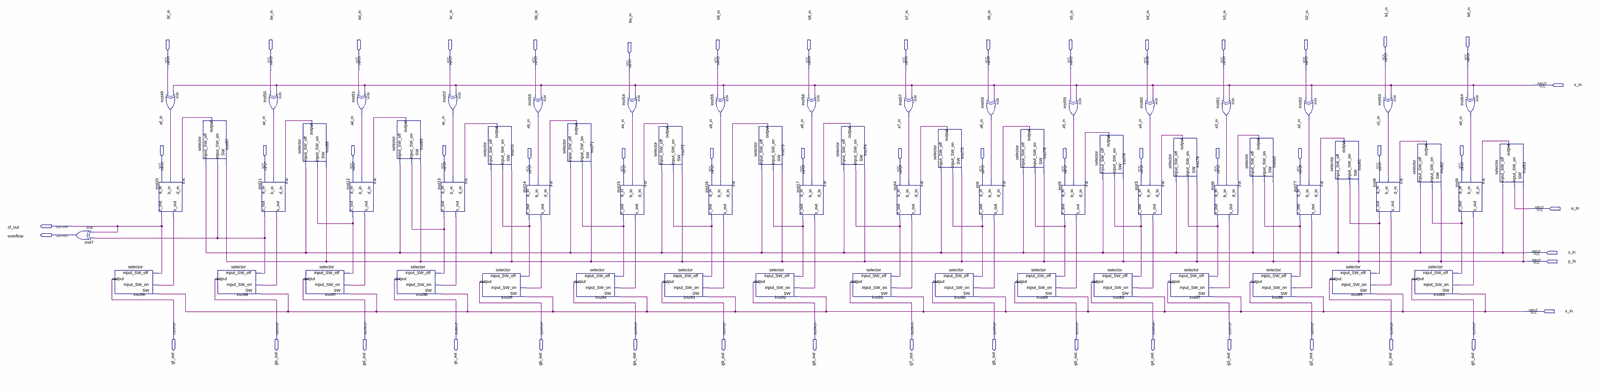
[diagram p0: schematic sheet, whole]
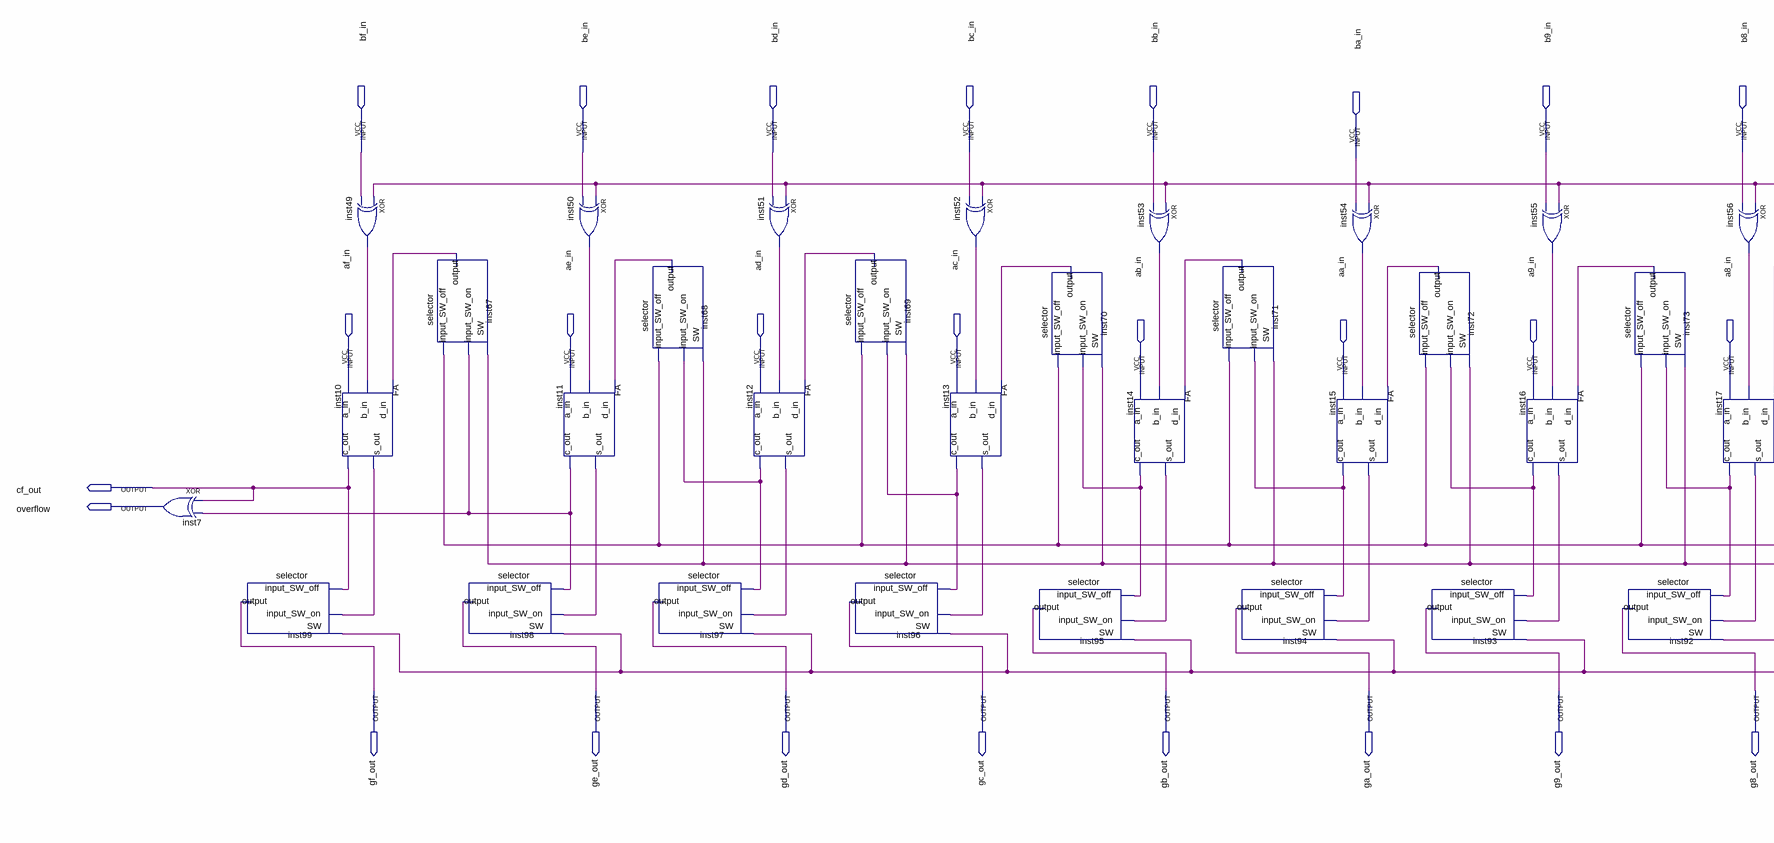
[diagram p1: schematic sheet, left part]
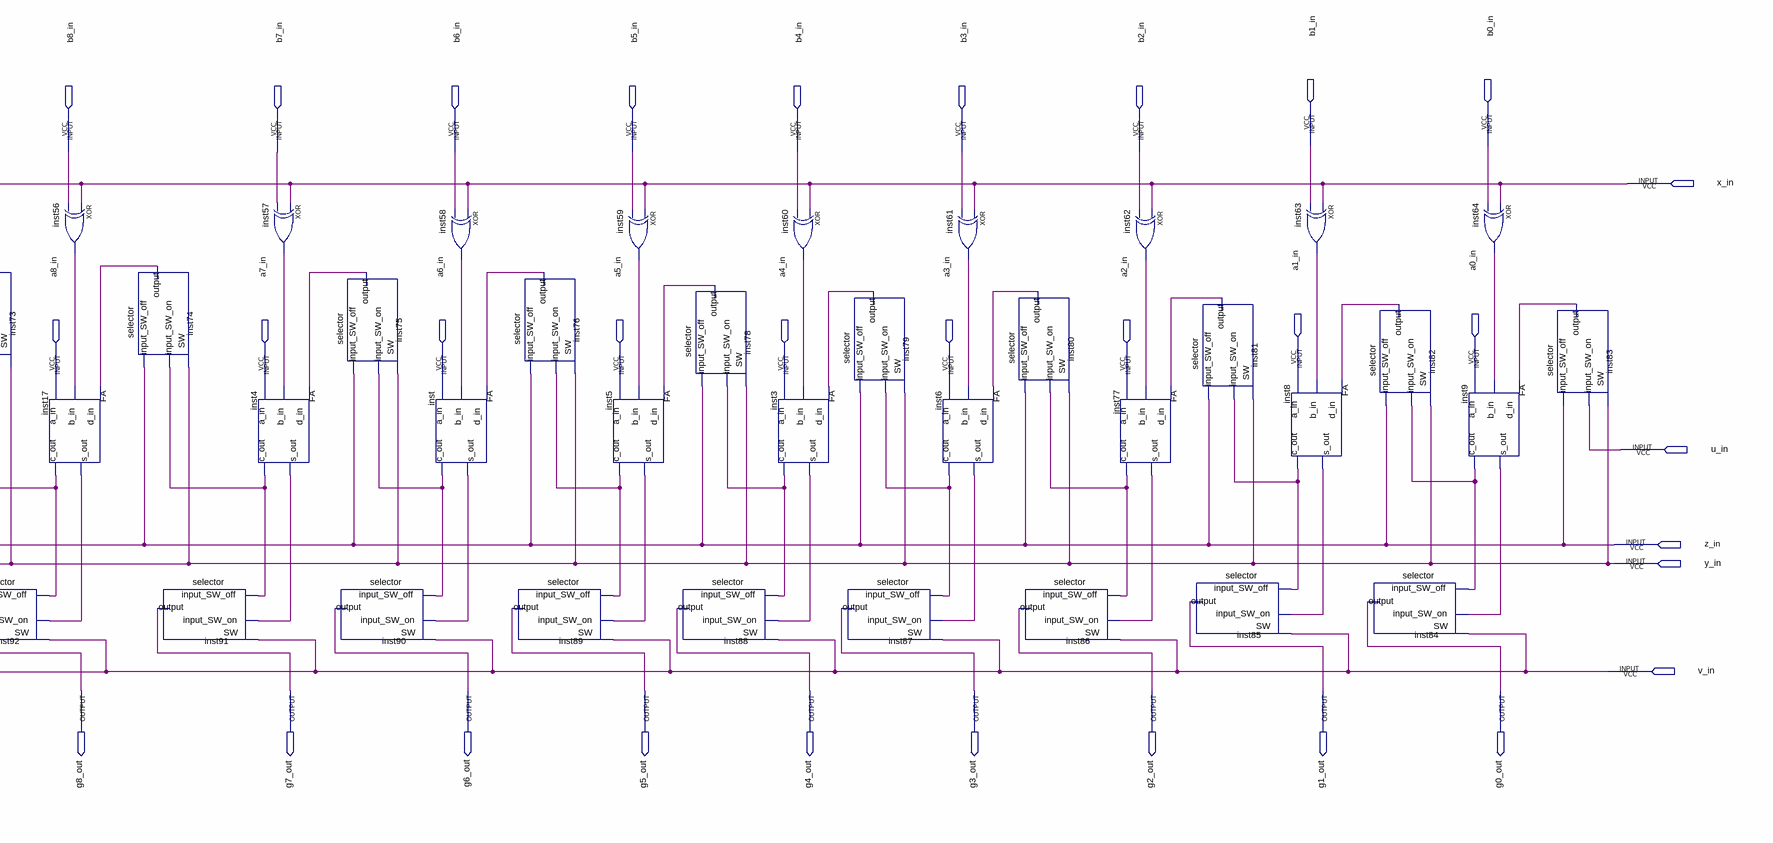
[diagram p2: schematic sheet, right part]
// Quartus schematic ALU.bdf as structural Verilog: 65 symbols, 55 pins
module ALU (
  input  b1_in,
  input  b0_in,
  input  bf_in,
  input  be_in,
  input  bd_in,
  input  bc_in,
  input  bb_in,
  input  b9_in,
  input  b8_in,
  input  b7_in,
  input  b6_in,
  input  b5_in,
  input  b4_in,
  input  b3_in,
  input  b2_in,
  input  ba_in,
  input  x_in,
  input  af_in,
  input  ae_in,
  input  ad_in,
  input  ac_in,
  input  a1_in,
  input  a0_in,
  input  ab_in,
  input  aa_in,
  input  a9_in,
  input  a8_in,
  input  a7_in,
  input  a6_in,
  input  a5_in,
  input  a4_in,
  input  a3_in,
  input  a2_in,
  input  u_in,
  input  z_in,
  input  y_in,
  input  v_in,
  output cf_out,
  output overflow,
  output gf_out,
  output ge_out,
  output gd_out,
  output gc_out,
  output gb_out,
  output ga_out,
  output g9_out,
  output g8_out,
  output g7_out,
  output g6_out,
  output g5_out,
  output g4_out,
  output g3_out,
  output g2_out,
  output g1_out,
  output g0_out
);

  wire inst3_c_out, inst3_s_out, inst4_c_out, inst4_s_out, inst5_c_out, inst5_s_out, inst6_c_out,
       inst6_s_out, inst8_c_out, inst8_s_out, inst9_c_out, inst9_s_out, inst10_s_out, inst11_c_out,
       inst11_s_out, inst12_c_out, inst12_s_out, inst13_c_out, inst13_s_out, inst14_c_out, inst14_s_out,
       inst15_c_out, inst15_s_out, inst16_c_out, inst16_s_out, inst17_c_out, inst17_s_out, inst49_out,
       inst50_out, inst51_out, inst52_out, inst53_out, inst54_out, inst55_out, inst56_out, inst57_out,
       inst58_out, inst59_out, inst60_out, inst61_out, inst62_out, inst63_out, inst64_out, inst67_output,
       inst68_output, inst69_output, inst70_output, inst71_output, inst72_output, inst73_output,
       inst74_output, inst75_output, inst76_output, inst77_c_out, inst77_s_out, inst78_output, inst79_output,
       inst80_output, inst81_output, inst82_output, inst83_output, inst_c_out, inst_s_out;

  xor inst7 (overflow, cf_out, inst11_c_out);
  selector inst99 (.input_SW_off(cf_out), .input_SW_on(inst10_s_out), .SW(v_in), .\output (gf_out));
  xor inst49 (inst49_out, x_in, bf_in);
  FA inst10 (.b_in(inst49_out), .a_in(af_in), .d_in(inst67_output), .c_out(cf_out), .s_out(inst10_s_out));
  selector inst67 (.input_SW_off(z_in), .input_SW_on(inst11_c_out), .SW(y_in), .\output (inst67_output));
  selector inst98 (.input_SW_off(inst11_c_out), .input_SW_on(inst11_s_out), .SW(v_in), .\output (ge_out));
  FA inst11 (.b_in(inst50_out), .a_in(ae_in), .d_in(inst68_output), .c_out(inst11_c_out), .s_out(inst11_s_out));
  xor inst50 (inst50_out, x_in, be_in);
  selector inst68 (.input_SW_off(z_in), .input_SW_on(inst12_c_out), .SW(y_in), .\output (inst68_output));
  selector inst97 (.input_SW_off(inst12_c_out), .input_SW_on(inst12_s_out), .SW(v_in), .\output (gd_out));
  xor inst51 (inst51_out, x_in, bd_in);
  FA inst12 (.b_in(inst51_out), .a_in(ad_in), .d_in(inst69_output), .c_out(inst12_c_out), .s_out(inst12_s_out));
  selector inst69 (.input_SW_off(z_in), .input_SW_on(inst13_c_out), .SW(y_in), .\output (inst69_output));
  selector inst96 (.input_SW_off(inst13_c_out), .input_SW_on(inst13_s_out), .SW(v_in), .\output (gc_out));
  xor inst52 (inst52_out, x_in, bc_in);
  FA inst13 (.b_in(inst52_out), .a_in(ac_in), .d_in(inst70_output), .c_out(inst13_c_out), .s_out(inst13_s_out));
  selector inst70 (.input_SW_off(z_in), .input_SW_on(inst14_c_out), .SW(y_in), .\output (inst70_output));
  selector inst95 (.input_SW_off(inst14_c_out), .input_SW_on(inst14_s_out), .SW(v_in), .\output (gb_out));
  xor inst53 (inst53_out, x_in, bb_in);
  FA inst14 (.b_in(inst53_out), .a_in(ab_in), .d_in(inst71_output), .c_out(inst14_c_out), .s_out(inst14_s_out));
  selector inst71 (.input_SW_off(z_in), .input_SW_on(inst15_c_out), .SW(y_in), .\output (inst71_output));
  selector inst94 (.input_SW_off(inst15_c_out), .input_SW_on(inst15_s_out), .SW(v_in), .\output (ga_out));
  xor inst54 (inst54_out, x_in, ba_in);
  FA inst15 (.b_in(inst54_out), .a_in(aa_in), .d_in(inst72_output), .c_out(inst15_c_out), .s_out(inst15_s_out));
  selector inst72 (.input_SW_off(z_in), .input_SW_on(inst16_c_out), .SW(y_in), .\output (inst72_output));
  selector inst93 (.input_SW_off(inst16_c_out), .input_SW_on(inst16_s_out), .SW(v_in), .\output (g9_out));
  FA inst16 (.b_in(inst55_out), .a_in(a9_in), .d_in(inst73_output), .c_out(inst16_c_out), .s_out(inst16_s_out));
  xor inst55 (inst55_out, x_in, b9_in);
  selector inst73 (.input_SW_off(z_in), .input_SW_on(inst17_c_out), .SW(y_in), .\output (inst73_output));
  selector inst92 (.input_SW_off(inst17_c_out), .input_SW_on(inst17_s_out), .SW(v_in), .\output (g8_out));
  FA inst17 (.b_in(inst56_out), .a_in(a8_in), .d_in(inst74_output), .c_out(inst17_c_out), .s_out(inst17_s_out));
  xor inst56 (inst56_out, x_in, b8_in);
  selector inst74 (.input_SW_off(z_in), .input_SW_on(inst4_c_out), .SW(y_in), .\output (inst74_output));
  selector inst91 (.input_SW_off(inst4_c_out), .input_SW_on(inst4_s_out), .SW(v_in), .\output (g7_out));
  FA inst4 (.b_in(inst57_out), .a_in(a7_in), .d_in(inst75_output), .c_out(inst4_c_out), .s_out(inst4_s_out));
  xor inst57 (inst57_out, x_in, b7_in);
  selector inst75 (.input_SW_off(z_in), .input_SW_on(inst_c_out), .SW(y_in), .\output (inst75_output));
  selector inst90 (.input_SW_off(inst_c_out), .input_SW_on(inst_s_out), .SW(v_in), .\output (g6_out));
  xor inst58 (inst58_out, x_in, b6_in);
  FA inst (.b_in(inst58_out), .a_in(a6_in), .d_in(inst76_output), .c_out(inst_c_out), .s_out(inst_s_out));
  selector inst76 (.input_SW_off(z_in), .input_SW_on(inst5_c_out), .SW(y_in), .\output (inst76_output));
  selector inst89 (.input_SW_off(inst5_c_out), .input_SW_on(inst5_s_out), .SW(v_in), .\output (g5_out));
  FA inst5 (.b_in(inst59_out), .a_in(a5_in), .d_in(inst78_output), .c_out(inst5_c_out), .s_out(inst5_s_out));
  xor inst59 (inst59_out, x_in, b5_in);
  selector inst78 (.input_SW_off(z_in), .input_SW_on(inst3_c_out), .SW(y_in), .\output (inst78_output));
  selector inst88 (.input_SW_off(inst3_c_out), .input_SW_on(inst3_s_out), .SW(v_in), .\output (g4_out));
  xor inst60 (inst60_out, x_in, b4_in);
  FA inst3 (.b_in(inst60_out), .a_in(a4_in), .d_in(inst79_output), .c_out(inst3_c_out), .s_out(inst3_s_out));
  selector inst79 (.input_SW_off(z_in), .input_SW_on(inst6_c_out), .SW(y_in), .\output (inst79_output));
  selector inst87 (.input_SW_off(inst6_c_out), .input_SW_on(inst6_s_out), .SW(v_in), .\output (g3_out));
  xor inst61 (inst61_out, x_in, b3_in);
  FA inst6 (.b_in(inst61_out), .a_in(a3_in), .d_in(inst80_output), .c_out(inst6_c_out), .s_out(inst6_s_out));
  selector inst80 (.input_SW_off(z_in), .input_SW_on(inst77_c_out), .SW(y_in), .\output (inst80_output));
  selector inst86 (.input_SW_off(inst77_c_out), .input_SW_on(inst77_s_out), .SW(v_in), .\output (g2_out));
  FA inst77 (.b_in(inst62_out), .a_in(a2_in), .d_in(inst81_output), .c_out(inst77_c_out), .s_out(inst77_s_out));
  xor inst62 (inst62_out, x_in, b2_in);
  selector inst81 (.input_SW_off(z_in), .input_SW_on(inst8_c_out), .SW(y_in), .\output (inst81_output));
  selector inst85 (.input_SW_off(inst8_c_out), .input_SW_on(inst8_s_out), .SW(v_in), .\output (g1_out));
  xor inst63 (inst63_out, x_in, b1_in);
  FA inst8 (.b_in(inst63_out), .a_in(a1_in), .d_in(inst82_output), .c_out(inst8_c_out), .s_out(inst8_s_out));
  selector inst82 (.input_SW_off(z_in), .input_SW_on(inst9_c_out), .SW(y_in), .\output (inst82_output));
  selector inst84 (.input_SW_off(inst9_c_out), .input_SW_on(inst9_s_out), .SW(v_in), .\output (g0_out));
  FA inst9 (.b_in(inst64_out), .a_in(a0_in), .d_in(inst83_output), .c_out(inst9_c_out), .s_out(inst9_s_out));
  xor inst64 (inst64_out, x_in, b0_in);
  selector inst83 (.input_SW_off(z_in), .input_SW_on(u_in), .SW(y_in), .\output (inst83_output));
endmodule
